# EAGLE design NeuroWing (EAGLE 7.4.0)
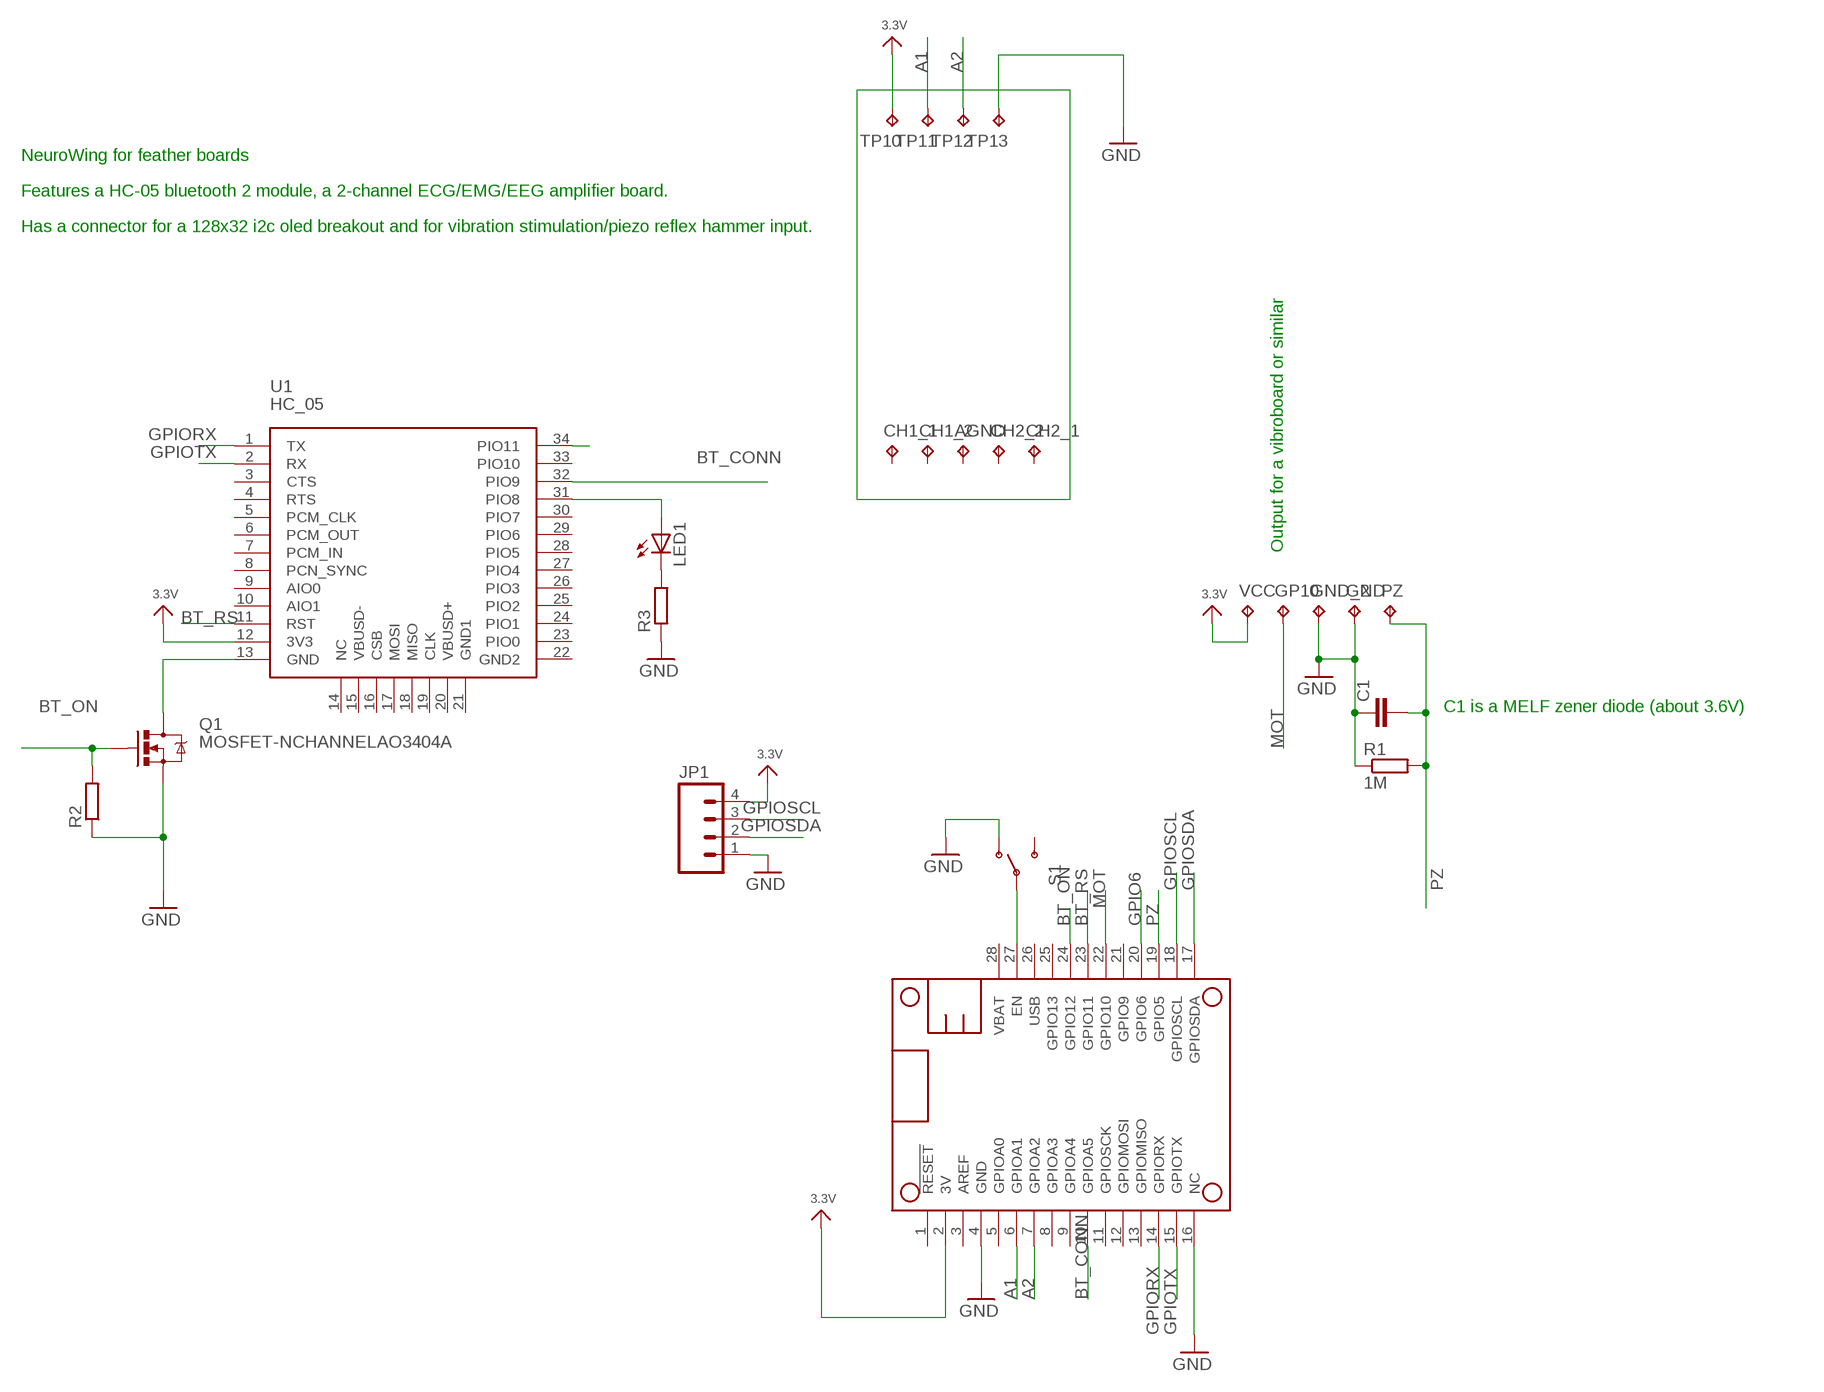
[diagram p0: schematic, sheet 1]

## Parts
AGND  TPTP17R  [TP17R]
C1  C-EUC1206  [C1206]
CH1_1  TPTP17R  [TP17R]
CH1_2  TPTP17R  [TP17R]
CH2_1  TPTP17R  [TP17R]
CH2_2  TPTP17R  [TP17R]
GND  TPTP20R  [TP20R]
GND_2  TPTP20R  [TP20R]
GP10  TPTP20R  [TP20R]
JP1  M04PTH  [1X04]
LED1  LEDCHIP-LED0805  [CHIP-LED0805]
MS2  FEATHERWING  [FEATHERWING]
PZ  TPTP20R  [TP20R]
Q1  MOSFET-NCHANNELAO3404A  [SOT23-3]
R1  1M  R-EU_R0603  [R0603]
R2  R-EU_R0603  [R0603]
R3  R-EU_R0603  [R0603]
S1  SWITCH-SPDT-SMD-A  [SWITCH-SPST-SMD-A]
TP10  TPTP17R  [TP17R]
TP11  TPTP17R  [TP17R]
TP12  TPTP17R  [TP17R]
TP13  TPTP17R  [TP17R]
U1  HC_05  [BLUETOOTH_SMD]
VCC  TPTP20R  [TP20R]

## Nets
3.3V: JP1.4 MS2.2(3V) TP10.TP U1.12(3V3) VCC.TP
A1: MS2.6(GPIOA1) TP11.TP
A2: MS2.7(GPIOA2) TP12.TP
BT_CONN: MS2.10(GPIOA5) U1.32(PIO9)
BT_ON: MS2.24(GPIO12) Q1.1(G) R2.2
BT_RS: MS2.23(GPIO11) U1.11(RST)
GND: C1.1 GND.TP GND_2.TP JP1.1 MS2.4(GND) MS2.16(NC) Q1.2(S) R1.1 R2.1 R3.1 S1.1(O) TP13.TP
GPIO6: MS2.20(GPIO6)
GPIORX: MS2.14(GPIORX) U1.1(TX)
GPIOSCL: JP1.3 MS2.18(GPIOSCL)
GPIOSDA: JP1.2 MS2.17(GPIOSDA)
GPIOTX: MS2.15(GPIOTX) U1.2(RX)
MOT: GP10.TP MS2.22(GPIO10)
N$2: Q1.3(D) U1.13(GND)
N$3: MS2.27(EN) S1.2(P)
N$5: LED1.C R3.2
N$6: U1.34(PIO11)
N$9: LED1.A U1.31(PIO8)
PZ: C1.2 MS2.19(GPIO5) PZ.TP R1.2
Unconnected: AGND.TP CH1_1.TP CH1_2.TP CH2_1.TP CH2_2.TP MS2.1(!RESET) MS2.3(AREF) MS2.5(GPIOA0) MS2.8(GPIOA3) MS2.9(GPIOA4) MS2.11(GPIOSCK) MS2.12(GPIOMOSI) MS2.13(GPIOMISO) MS2.21(GPIO9) MS2.25(GPIO13) MS2.26(USB) MS2.28(VBAT) S1.3(S) U1.3(CTS) U1.4(RTS) U1.5(PCM_CLK) U1.6(PCM_OUT) U1.7(PCM_IN) U1.8(PCN_SYNC) U1.9(AIO0) U1.10(AIO1) U1.14(NC) U1.15(VBUSD-) U1.16(CSB) U1.17(MOSI) U1.18(MISO) U1.19(CLK) U1.20(VBUSD+) U1.21(GND1) U1.22(GND2) U1.23(PIO0) U1.24(PIO1) U1.25(PIO2) U1.26(PIO3) U1.27(PIO4) U1.28(PIO5) U1.29(PIO6) U1.30(PIO7) U1.33(PIO10)

## Notes on the sheet
- NeuroWing for feather boards
- Features a HC-05 bluetooth 2 module, a 2-channel ECG/EMG/EEG amplifier board.
- Has a connector for a 128x32 i2c oled breakout and for vibration stimulation/piezo reflex hammer input.
- Output for a vibroboard or similar
- C1 is a MELF zener diode (about 3.6V)

## Library data of the parts
AGND CH1_1 CH1_2 CH2_1 CH2_2 GND GND_2 GP10 PZ TP10-TP13 VCC = testpad:TP: Test pad
C1 = rcl:C-EU: CAPACITOR, European symbol
JP1 = SparkFun-Connectors:M04: Header 4 Standard 4-pin 0.1" header. Use with straight break away headers (SKU : PRT-00116), right angle break away headers (PRT-00553), swiss pins (PRT-00743), machine pins (PRT-00117), and female headers (PRT-00115). Molex polarized connector foot print use with SKU : PRT-08231 with associated crimp pins and housings. 1MM SMD Version SKU: PRT-10208
LED1 = adafruit:LED: LED OSRAM: - CHIPLED LG R971, LG N971, LY N971, LG Q971, LY Q971, LO R971, LY R971 LH N974, LH R974 LS Q976, LO Q976, LY Q976 LO Q996 - Hyper CHIPLED LW Q18S LB Q993, LB Q99A, LB R99A - SideLED LS A670, LO A670, LY A670, LG A670, LP A670 LB A673, LV A673, LT A673, LW A673 LH A674 LY A675 LS A676, LA A676, LO A676, LY A676, LW A676 LS A679, LY A679, LG A679 - Hyper Micro SIDELED® LS Y876, LA Y876, LO Y876, LY Y876 LT Y87S - SmartLED LW L88C, LW L88S LB L89C, LB L89S, LG L890 LS L89K, LO L89K, LY L89K LS L896, LA L896, LO L896, LY L896 - TOPLED LS T670, LO T670, LY T670, LG T670, LP T670 LSG T670, LSP T670, LSY T670, LOP T670, LYG T670 LG T671, LOG T671, LSG T671 LB T673, LV T673, LT T673, LW T673 LH T674 LS T676, LA T676, LO T676, LY T676, LB T676, LH T676, LSB T676, LW T676 LB T67C, LV T67C, LT T67C, LS T67K, LO T67K, LY T67K, LW E67C LS E67B, LA E67B, LO E67B, LY E67B, LB E67C, LV E67C, LT E67C LW T67C LS T679, LY T679, LG T679 LS T770, LO T770, LY T770, LG T770, LP T770 LB T773, LV T773, LT T773, LW T773 LH T774 LS E675, LA E675, LY E675, LS T675 LS T776, LA T776, LO T776, LY T776, LB T776 LHGB T686 LT T68C, LB T68C - Hyper Mini TOPLED® LB M676 - Mini TOPLED Santana® LG M470 LS M47K, LO M47K, LY M47K Source: http://www.osram.convergy.de/
MS2 = microbuilder:FEATHERWING
Q1 = SparkFun-DiscreteSemi:MOSFET-NCHANNEL: Common NMOSFET Parts MFG P/N Store ID Prod ID FDD8780 TRANS-09984 SI7820DN TRANS-11055 FDS6630A IC-08089 2N7002PW TRANS-11151 FQP30N06L COM-10213 TRANS-10060 BSS123LT1G TRANS-08345 BSS138 TRANS-00830 BS170 2N7000; PROD_ID: TRAN-12988
R1-R3 = rcl:R-EU_: RESISTOR, European symbol
S1 = SparkFun-Electromechanical:SWITCH-SPDT: SPDT Switch Simple slide switch, Spark Fun Electronics SKU : COM-00102 DPDT SMT slide switch, AYZ0202, SWCH-08179
U1 = Bluetooth HC-05:HC_05: HC-05 Bluetooth Module

## Board
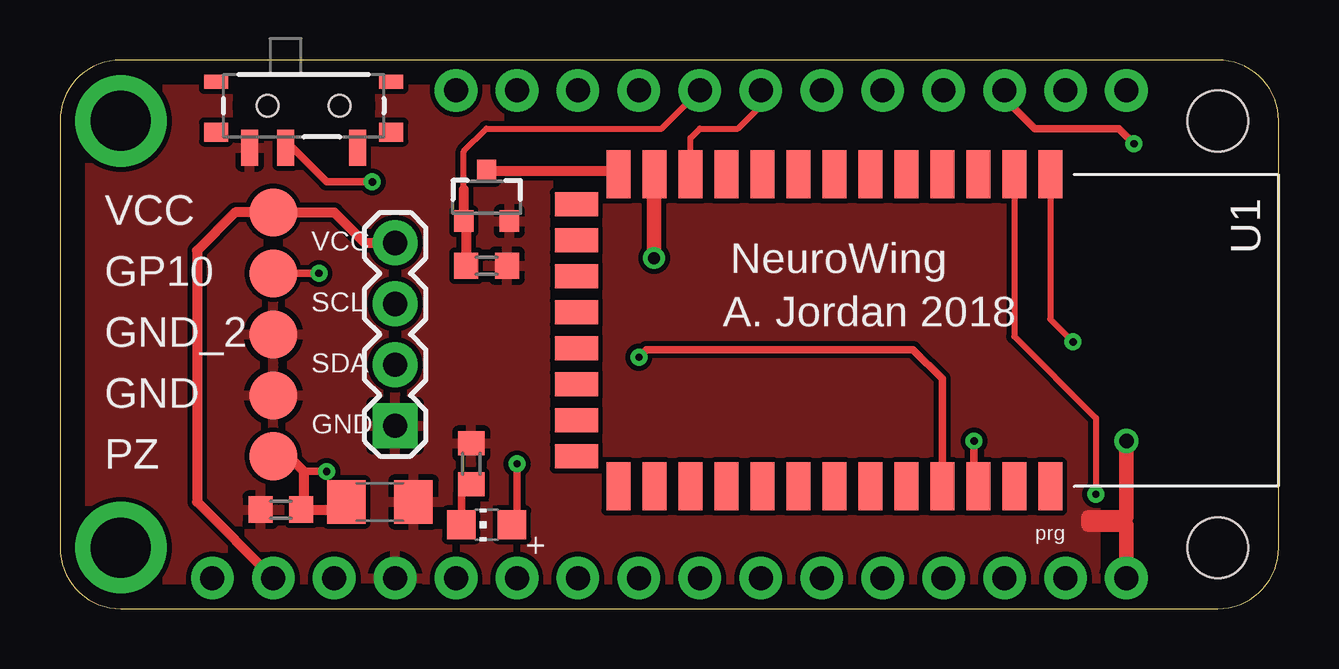
[diagram p1: board, top side]
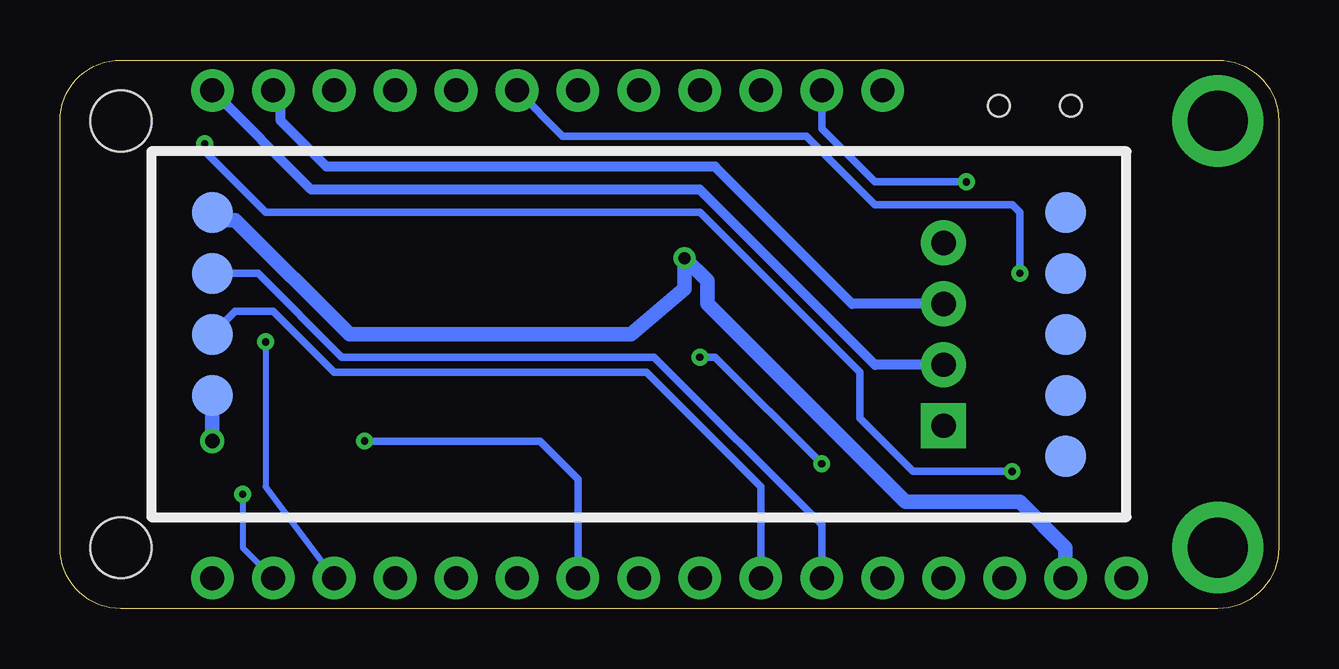
[diagram p2: board, bottom side, seen from below]

Size 50.8 x 22.86 mm. Coordinates in mm from the lower left corner, seen from the top.
Copper layers (1*16): Top 0.035mm / dielectric 1.5mm / Bottom 0.035mm
Design rules "default *": minimum track width 10mil, minimum drill 24mil, track to track 8mil, track to pad 8mil, pad to pad 8mil, via to via 8mil, smd to smd 8mil, copper to edge 40mil, drill to drill 8mil, minimum pad ring 10mil, minimum via ring 8mil, stop-mask expansion 4mil, vias tented up to drill 20mil, thermal gap 10mil

### Footprints (pad centres in the part's own frame; a part is rotated, then mirrored left to right if it is on the bottom)
TP17R = smd 1.7 x 1.7: TP 0,0
C1206 = smd 1.6 x 1.8: 1 -1.4,0; 2 1.4,0
TP20R = smd 2 x 2: TP 0,0
1X04 = drill 1.016 pad 1.88 square: 1 0,0 | drill 1.016 pad 1.88: 2 2.54,0; 3 5.08,0; 4 7.62,0
CHIP-LED0805 = smd 1.2 x 1.2: A 0,-1.05; C 0,1.05
FEATHERWING = drill 1 pad 1.778: 1 6.35,1.27; 2 8.89,1.27; 3 11.43,1.27; 4 13.97,1.27; 5 16.51,1.27; 6 19.05,1.27; 7 21.59,1.27; 8 24.13,1.27; 9 26.67,1.27; 10 29.21,1.27; 11 31.75,1.27; 12 34.29,1.27; 13 36.83,1.27; 14 39.37,1.27; 15 41.91,1.27; 16 44.45,1.27; 17 44.45,21.59; 18 41.91,21.59; 19 39.37,21.59; 20 36.83,21.59; 21 34.29,21.59; 22 31.75,21.59; 23 29.21,21.59; 24 26.67,21.59; 25 24.13,21.59; 26 21.59,21.59; 27 19.05,21.59; 28 16.51,21.59 | drill 2.5 pad 3.81: P$1 2.54,20.32; P$2 2.54,2.54 | hole 2.54: 48.26,20.32; 48.26,2.54
SOT23-3 = smd 0.8 x 0.9: 1 -0.95,-1; 2 0.95,-1; 3 0,1.1
R0603 = smd 1 x 1.1: 1 -0.85,0; 2 0.85,0
SWITCH-SPST-SMD-A = smd 0.7 x 1.5: 1 -2.25,-1.75; 2 -0.75,-1.75; 3 2.25,-1.75 | smd 1 x 0.6: GND1 -3.65,1; GND3 3.65,1 | smd 1 x 0.8: GND2 -3.65,-1.1; GND4 3.65,-1.1 | hole 0.9: -1.5,0; 1.5,0
BLUETOOTH_SMD = smd 2 x 1: 1 -6.35,3.81; 2 -6.35,2.31; 3 -6.35,0.81; 4 -6.35,-0.69; 5 -6.35,-2.19; 6 -6.35,-3.69; 7 -6.35,-5.19; 8 -6.35,-6.69; 9 -6.35,-8.19; 10 -6.35,-9.69; 11 -6.35,-11.19; 12 -6.35,-12.69; 13 -6.35,-14.19; 22 6.65,-14.19; 23 6.65,-12.69; 24 6.65,-11.19; 25 6.65,-9.69; 26 6.65,-8.19; 27 6.65,-6.69; 28 6.65,-5.19; 29 6.65,-3.69; 30 6.65,-2.19; 31 6.65,-0.69; 32 6.65,0.81; 33 6.65,2.31; 34 6.65,3.81 | smd 1 x 1.8: 14 -5.1,-15.94; 15 -3.6,-15.94; 16 -2.1,-15.94; 17 -0.6,-15.94; 18 0.9,-15.94; 19 2.4,-15.94; 20 3.9,-15.94; 21 5.4,-15.94

### Placement (x,y rotation side)
AGND  8.89,11.43 0 bottom
C1  13.34,4.45 180 top
CH1_1  8.89,16.51 0 bottom
CH1_2  8.89,13.97 0 bottom
CH2_1  8.89,6.35 0 bottom
CH2_2  8.89,8.89 0 bottom
GND  8.89,8.89 0 top
GND_2  8.89,11.43 0 top
GP10  8.89,13.97 0 top
JP1  13.97,7.62 90 top
LED1  17.78,3.49 90 top
MS2  0,0 0 top
PZ  8.89,6.35 0 top
Q1  17.78,17.14 0 top
R1  9.21,4.13 0 top
R2  17.78,14.29 180 top
R3  17.14,6.03 270 top
S1  10.16,20.95 0 top
TP10  44.45,16.51 0 bottom
TP11  44.45,13.97 0 bottom
TP12  44.45,11.43 0 bottom
TP13  44.45,8.89 0 bottom
U1  37.47,11.75 270 top
VCC  8.89,16.51 0 top

### Tracks (layer width: path | path; a pad name or v marks a point on that pad's centre or on a via)
3.3V  (via drill 0.5)
  Top 0.406: MS2.2 5.71,4.45 5.71,14.92 7.3,16.51 VCC.TP 11.43,16.51 12.7,15.24 JP1.4
  Top 0.61: v24.77,14.61 24.77,17.77 U1.12
  Bottom 0.61: MS2.2 8.89,2.54 10.79,4.45 15.56,4.45 23.81,12.7 23.81,13.65 v24.77,14.61 24.77,13.34 26.99,11.43 38.73,11.43 43.5,16.19 44.13,16.19 TP10.TP
A1
  Bottom 0.305: MS2.6 19.05,3.49 26.04,10.48 39.05,10.48 42.55,13.97 TP11.TP
A2
  Bottom 0.305: MS2.7 21.59,5.08 26.35,9.84 39.37,9.84 41.91,12.38 43.5,12.38 TP12.TP
BT_CONN  (via drill 0.3)
  Top 0.305: v38.1,6.99 38.1,4.76 38.42,4.45 38.42,4.96 U1.32
  Bottom 0.305: MS2.10 29.21,5.4 30.8,6.99 v38.1,6.99
BT_ON
  Top 0.254: 16.83,17.46 16.83,19.05 17.78,20 25.08,20 MS2.24
  Top 0.406: 16.83,17.46 Q1.1 16.93,16.14 R2.2
BT_RS
  Top 0.254: U1.11 26.27,19.61 26.67,20 28.26,20 29.21,20.95 MS2.23
GND  (via drill 0.6)
  Top 0.61: v44.45,6.99 44.45,3.81 42.86,3.81 42.86,3.49 44.45,3.49 MS2.16
  Bottom 0.61: v44.45,6.99 TP13.TP
  pour Top: -2.54,25.4 -2.54,-2.54 43.18,-2.54 43.18,25.4
GPIORX  (via drill 0.3)
  Top 0.254: U1.1 41.27,12.06 v42.23,11.11
  Bottom 0.254: v42.23,11.11 42.23,5.08 MS2.14
GPIOSCL
  Bottom 0.406: JP1.3 17.78,12.7 23.5,18.41 39.69,18.41 41.59,20.32 41.59,21.27 MS2.18
GPIOSDA
  Bottom 0.406: JP1.2 16.83,10.16 24.13,17.46 40.32,17.46 MS2.17
GPIOTX  (via drill 0.3)
  Top 0.254: U1.2 39.77,11.34 43.18,7.94 v43.18,4.76
  Bottom 0.254: v43.18,4.76 43.18,2.54 MS2.15
MOT  (via drill 0.3)
  Top 0.305: GP10.TP v10.79,13.97
  Bottom 0.305: MS2.22 29.84,19.68 19.68,19.68 16.83,16.83 11.11,16.83 10.79,16.51 v10.79,13.97
N$2
  Top 0.406: Q1.3 23.13,18.25 U1.13
N$3  (via drill 0.3)
  Top 0.305: S1.2 9.69,19.2 11.11,17.78 v13.02,17.78
  Bottom 0.305: v13.02,17.78 16.83,17.78 19.05,20 MS2.27
N$5
  Top 0.305: LED1.C 16.73,4.77 R3.2
N$9  (via drill 0.3)
  Top 0.305: U1.31 36.77,9.58 35.56,10.79 24.45,10.79 v24.13,10.48 | v19.05,6.03 19.05,3.71 LED1.A
  Bottom 0.305: v24.13,10.48 23.5,10.48 v19.05,6.03
PZ  (via drill 0.3)
  Top 0.305: MS2.19 39.37,21.27 40.64,20 44.13,20 v44.77,19.37 | v11.11,5.71 10.16,5.71
  Top 0.406: PZ.TP 9.53,6.35 10.16,5.71 10.16,4.23 R1.2 11.62,4.13 C1.2
  Bottom 0.305: v44.77,19.37 44.77,19.05 42.23,16.51 24.13,16.51 17.46,9.84 17.46,7.94 15.24,5.71 v11.11,5.71

### Text on the board
tPlace: VCC | NeuroWing | SCL | A. Jordan 2018 | SDA | GND | prg